# Altium schematic sheet On Grid Hybrid 5Kw.Deye.SchDoc
size 549 x 200 mm
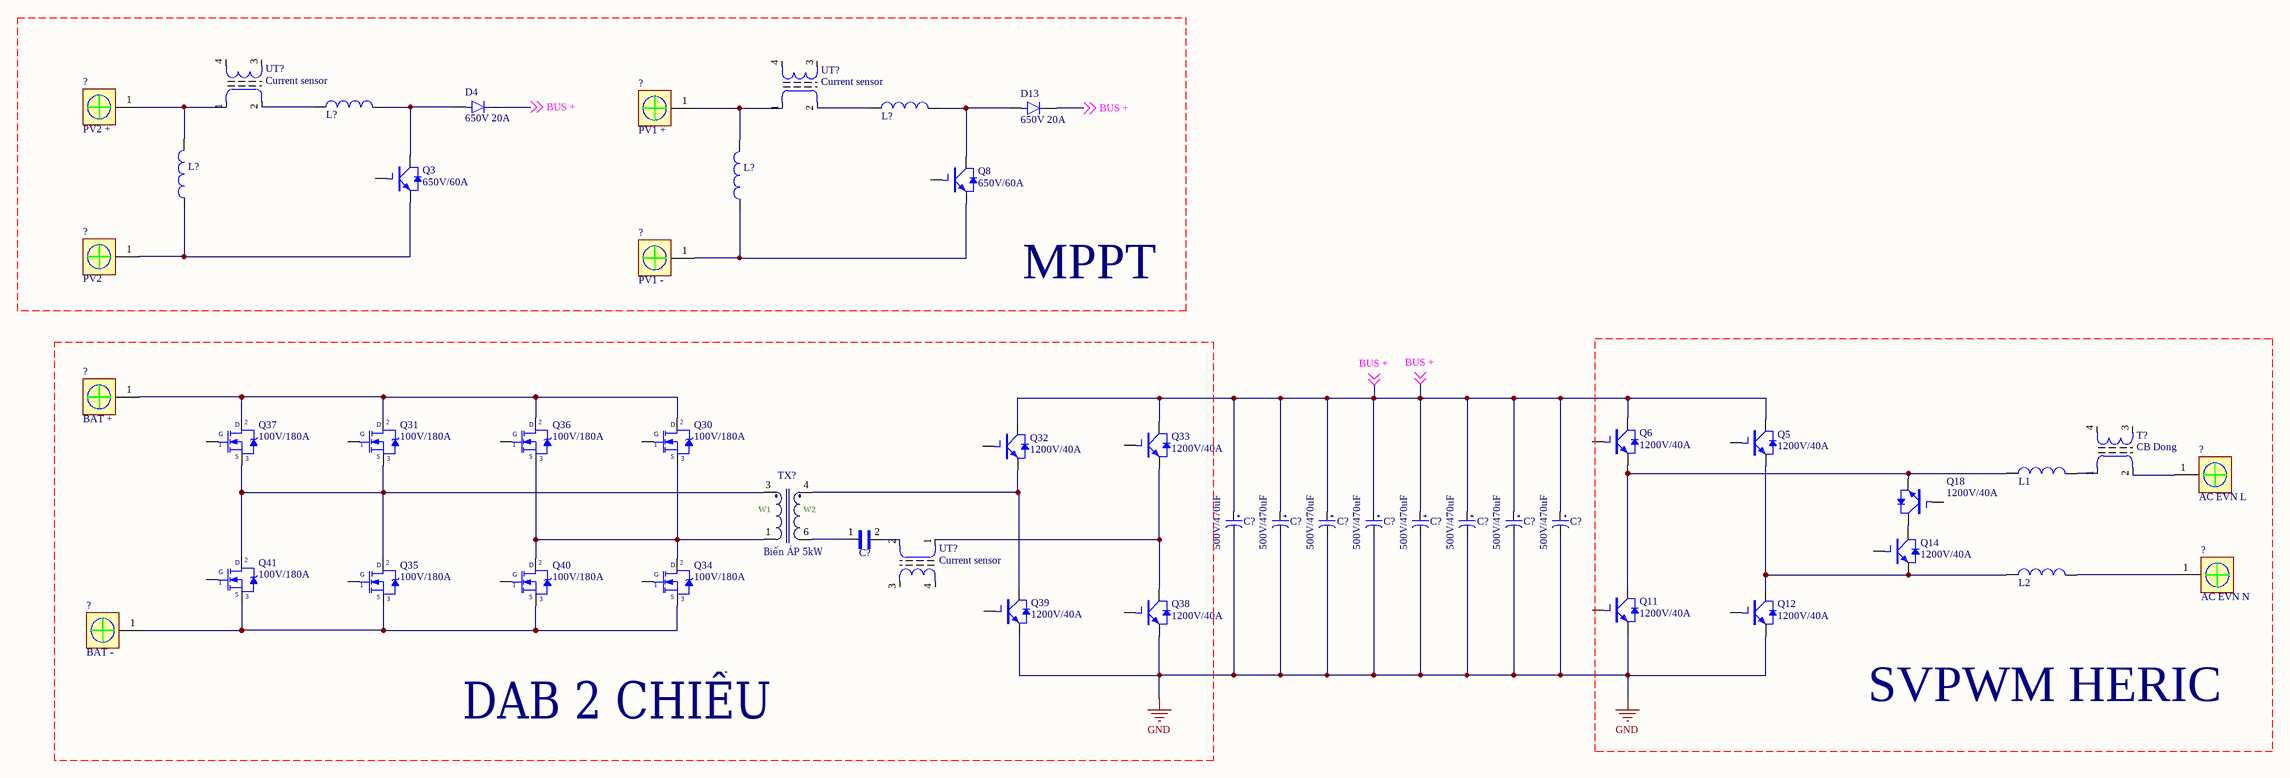
[diagram p0: On Grid Hybrid 5Kw.Deye.SchDoc]

## Parts
(Parts that share a designator on the sheet are numbered #1, #2 ... from top to bottom, then left to right.)
?#1  PV2 +  [Copper Pipe]
?#2  PV1 +  [Copper Pipe]
?#3  PV2  [Copper Pipe]
?#4  PV1 -  [Copper Pipe]
?#5  BAT +  [Copper Pipe]
?#6  AC EVN L  [Copper Pipe]
?#7  AC EVN N  [Copper Pipe]
?#8  BAT -  [Copper Pipe]
C?#1  500V/470uF  [CAP-10X17-N]
C?#2  500V/470uF  [CAP-10X17-N]
C?#3  500V/470uF  [CAP-10X17-N]
C?#4  500V/470uF  [CAP-10X17-N]
C?#5  500V/470uF  [CAP-10X17-N]
C?#6  500V/470uF  [CAP-10X17-N]
C?#7  500V/470uF  [CAP-10X17-N]
C?#8  500V/470uF  [CAP-10X17-N]
C?#9  CBB 470nF/630V  [CAPRR2250W80L2600T850H1500]  (value not drawn)
D4  650V 20A  [TO-220AC-2]
D13  650V 20A  [TO-220AC-2]
L1  Cuộn L  [IND_1210]  (value not drawn)
L2  Cuộn L  [IND_1210]  (value not drawn)
L?#1  Cuộn L  [IND_1210]  (value not drawn)
L?#2  Cuộn L  [IND_1210]  (value not drawn)
L?#3  Cuộn L  [IND_1210]  (value not drawn)
L?#4  Cuộn L  [IND_1210]  (value not drawn)
Q3  650V/60A  [TO-3P]
Q5  1200V/40A  [TO-3P]
Q6  1200V/40A  [TO-3P]
Q8  650V/60A  [TO-3P]
Q11  1200V/40A  [TO-3P]
Q12  1200V/40A  [TO-3P]
Q14  1200V/40A  [TO-3P]
Q18  1200V/40A  [TO-3P]
Q30  100V/180A  [TO220H1]
Q31  100V/180A  [TO220H1]
Q32  1200V/40A  [TO-3P]
Q33  1200V/40A  [TO-3P]
Q34  100V/180A  [TO220H1]
Q35  100V/180A  [TO220H1]
Q36  100V/180A  [TO220H1]
Q37  100V/180A  [TO220H1]
Q38  1200V/40A  [TO-3P]
Q39  1200V/40A  [TO-3P]
Q40  100V/180A  [TO220H1]
Q41  100V/180A  [TO220H1]
T?  CB Dong  [Bien ap do Current]
TX?  Biến ÁP 5kW  [EE13/7/4-Vertical/(EF12.6)]
UT?#1  Current sensor  [Bien ap do Current]
UT?#2  Current sensor  [Bien ap do Current]
UT?#3  Current sensor  [Bien ap do Current]

## Nets
GND: C?#1.2 C?#2.2 C?#3.2 C?#4.2 C?#5.2 C?#6.2 C?#7.2 C?#8.2 Q11.3(E) Q12.3(E) Q38.3(E) Q39.3(E)
BUS +: C?#1.1 C?#2.1 C?#3.1 C?#4.1 C?#5.1 C?#6.1 C?#7.1 C?#8.1 D4.1(K) D13.1(K) Q5.2(C) Q6.2(C) Q32.2(C) Q33.2(C) ; off-sheet BUS +
Net?#1_1: ?#1.1 L?#3.2 UT?#1.1
Net?#2_1: ?#2.1 L?#4.2 UT?#2.1
Net?#3_1: ?#3.1 L?#3.1 Q3.3(E)
Net?#4_1: ?#4.1 L?#4.1 Q8.3(E)
Net?#5_1: ?#5.1 Q30.2(D) Q31.2(D) Q36.2(D) Q37.2(D)
Net?#6_1: ?#6.1 T?.2
Net?#7_1: ?#7.1 L2.2
Net?#8_1: ?#8.1 Q34.3(S) Q35.3(S) Q40.3(S) Q41.3(S)
NetC?#9_1: C?#9.1 TX?.6
NetC?#9_2: C?#9.2 UT?#3.2
NetD4_3: D4.3(A) L?#1.2 Q3.2(C)
NetD13_3: D13.3(A) L?#2.2 Q8.2(C)
NetL1_1: L1.1 Q6.3(E) Q11.2(C) Q18.3(E)
NetL1_2: L1.2 T?.1
NetL2_1: L2.1 Q5.3(E) Q12.2(C) Q14.3(E)
NetL?#1_1: L?#1.1 UT?#1.2
NetL?#2_1: L?#2.1 UT?#2.2
NetQ14_2: Q14.2(C) Q18.2(C)
NetQ30_3: Q30.3(S) Q34.2(D) Q36.3(S) Q40.2(D) TX?.1
NetQ31_3: Q31.3(S) Q35.2(D) Q37.3(S) Q41.2(D) TX?.3
NetQ32_3: Q32.3(E) Q39.2(C) TX?.4
NetQ33_3: Q33.3(E) Q38.2(C) UT?#3.1

Not connected (* = marked no-connect by the designer): Q3 1(G); Q5 1(G); Q6 1(G); Q8 1(G); Q11 1(G); Q12 1(G); Q14 1(G); Q18 1(G); Q30 1(G); Q31 1(G); Q32 1(G); Q33 1(G); Q34 1(G); Q35 1(G); Q36 1(G); Q37 1(G); Q38 1(G); Q39 1(G); Q40 1(G); Q41 1(G); T? 3 4; UT?#1 3 4; UT?#2 3 4; UT?#3 3 4

## Notes on the sheet
- MPPT
- DAB 2 CHIỀU
- SVPWM HERIC
- (in symbol Tranf7) W1; W2

## Library data of the parts
?#1-?#8 = Copper
C?#1-C?#8 = Cap - 10x18 - N: Cắm; Don_Vi: Con; So_Chan: 2; Ten_Linh_Kien: Tụ Hóa 220uF 10V 6x11MM; Ma_Hang: MH004510; Chung_Loai: Cắm; Kieu_Chan: *
C?#9 = ECWFG2J475KA: Metallized Polypropylene Film Capacitor; MF: Panasonic; Value: *; Price: None; Package: MOLDED-2 Panasonic; MP: ECWFG2J475KA; Availability: In Stock; Check_prices: https://www.snapeda.com/parts/ECWFG2J475KA/Panasonic/view-part/?ref=eda; SnapEDA_Link: https://www.snapeda.com/parts/ECWFG2J475KA/Panasonic/view-part/?ref=snap
D4 D13 = MUR1560: CRXU20D065G2; MF: ON Semiconductor; Arrow_Electronics-Purchase-URL: https://snapeda.com/shop?store=Arrow+Electronics&id=621574; Value: *; SnapEDA_Link: https://www.snapeda.com/parts/MUR1560/ON%20Semiconductor/view-part/621574/?ref=snap; Package: TO-220 ON Semiconductor; MP: MUR1560
L1 L2 L?#1-L?#4 = IND_18uH-0.12A-10%-SMD: Fixed Inductors 18uH 10% 2.52MHz; Manufacturer: Wurth Electronics; Manufacturer Part Number: CMH322522-180KL; Alternate Part Number-1: NA; Case/Package: SMD; Supplier-1: ARROW; Supplier Part Number-1: CMH322522-180KL
Q3 Q8 = FGA25N120ANTD: 60T65PES; MF: ON Semiconductor; Value: *; Digi-Key_Purchase_URL: https://www.digikey.in/product-detail/en/on-semiconductor/FGA25N120ANTDTU/FGA25N120ANTDTU-ND/820640?utm_source=snapeda&utm_medium=aggregator&utm_campaign=symbol; MP: FGA25N120ANTD; Package: TO-3 Fairchild Semiconductor; SnapEDA_Link: https://www.snapeda.com/parts/FGA25N120ANTD/ON%20Semiconductor/view-part/202622/?ref=snap; Digi-Key_Part_Number: FGA25N120ANTDTU-ND
Q5 Q6 Q11 Q12 Q14 Q18 Q32 Q33 Q38 Q39 = FGA25N120ANTD: CRG40T120AK3SD; MF: ON Semiconductor; Value: *; Digi-Key_Purchase_URL: https://www.digikey.in/product-detail/en/on-semiconductor/FGA25N120ANTDTU/FGA25N120ANTDTU-ND/820640?utm_source=snapeda&utm_medium=aggregator&utm_campaign=symbol; MP: FGA25N120ANTD; Package: TO-3 Fairchild Semiconductor; SnapEDA_Link: https://www.snapeda.com/parts/FGA25N120ANTD/ON%20Semiconductor/view-part/202622/?ref=snap; Digi-Key_Part_Number: FGA25N120ANTDTU-ND
Q30 Q31 Q34-Q37 Q40 Q41 = MOSFET IRF N: CRSQ027N10NZ; Value: IRF840
T? UT?#1-UT?#3 = Bien ap dong: Biến áp đo dòng; Value: Loc 220; Designed by: VanDungEvn
TX? = Tranf7: Off-Line Transformer WE-UNIT , L=2.8mH; PartNo: 7491181012; Manufacturer: Würth Elektronik eiSos GmbH; Inductance: 2.8mH; Turns Ratio: 8.1:1; Input Voltage (AC): 85-265; Output Current (A): 0.25; Output Voltage (DC): 12; ComponentLink1Description: Manufacturer; ComponentLink1URL: http://www.we-online.de; Created by: Otto Christin; Created Date: OCT 2013; ComponentLink2Description: Datasheet; ComponentLink2URL: http://www.we-online.de/katalog/media/pdf/7491181012.pdf